# EasyEDA Pro project 2.4G8通道接收板2代.epro

# Schematic 2.4G8通道接收板3代
Create Date: 2024-01-06; Page Name: P1; Project Name: 遥控小车驱动小板; Schematic Name: 2.4G8通道接收板3代; Update Date: 2024-01-06; Company: 嘉立创EDA; Page Size: A4; Version: V1.0
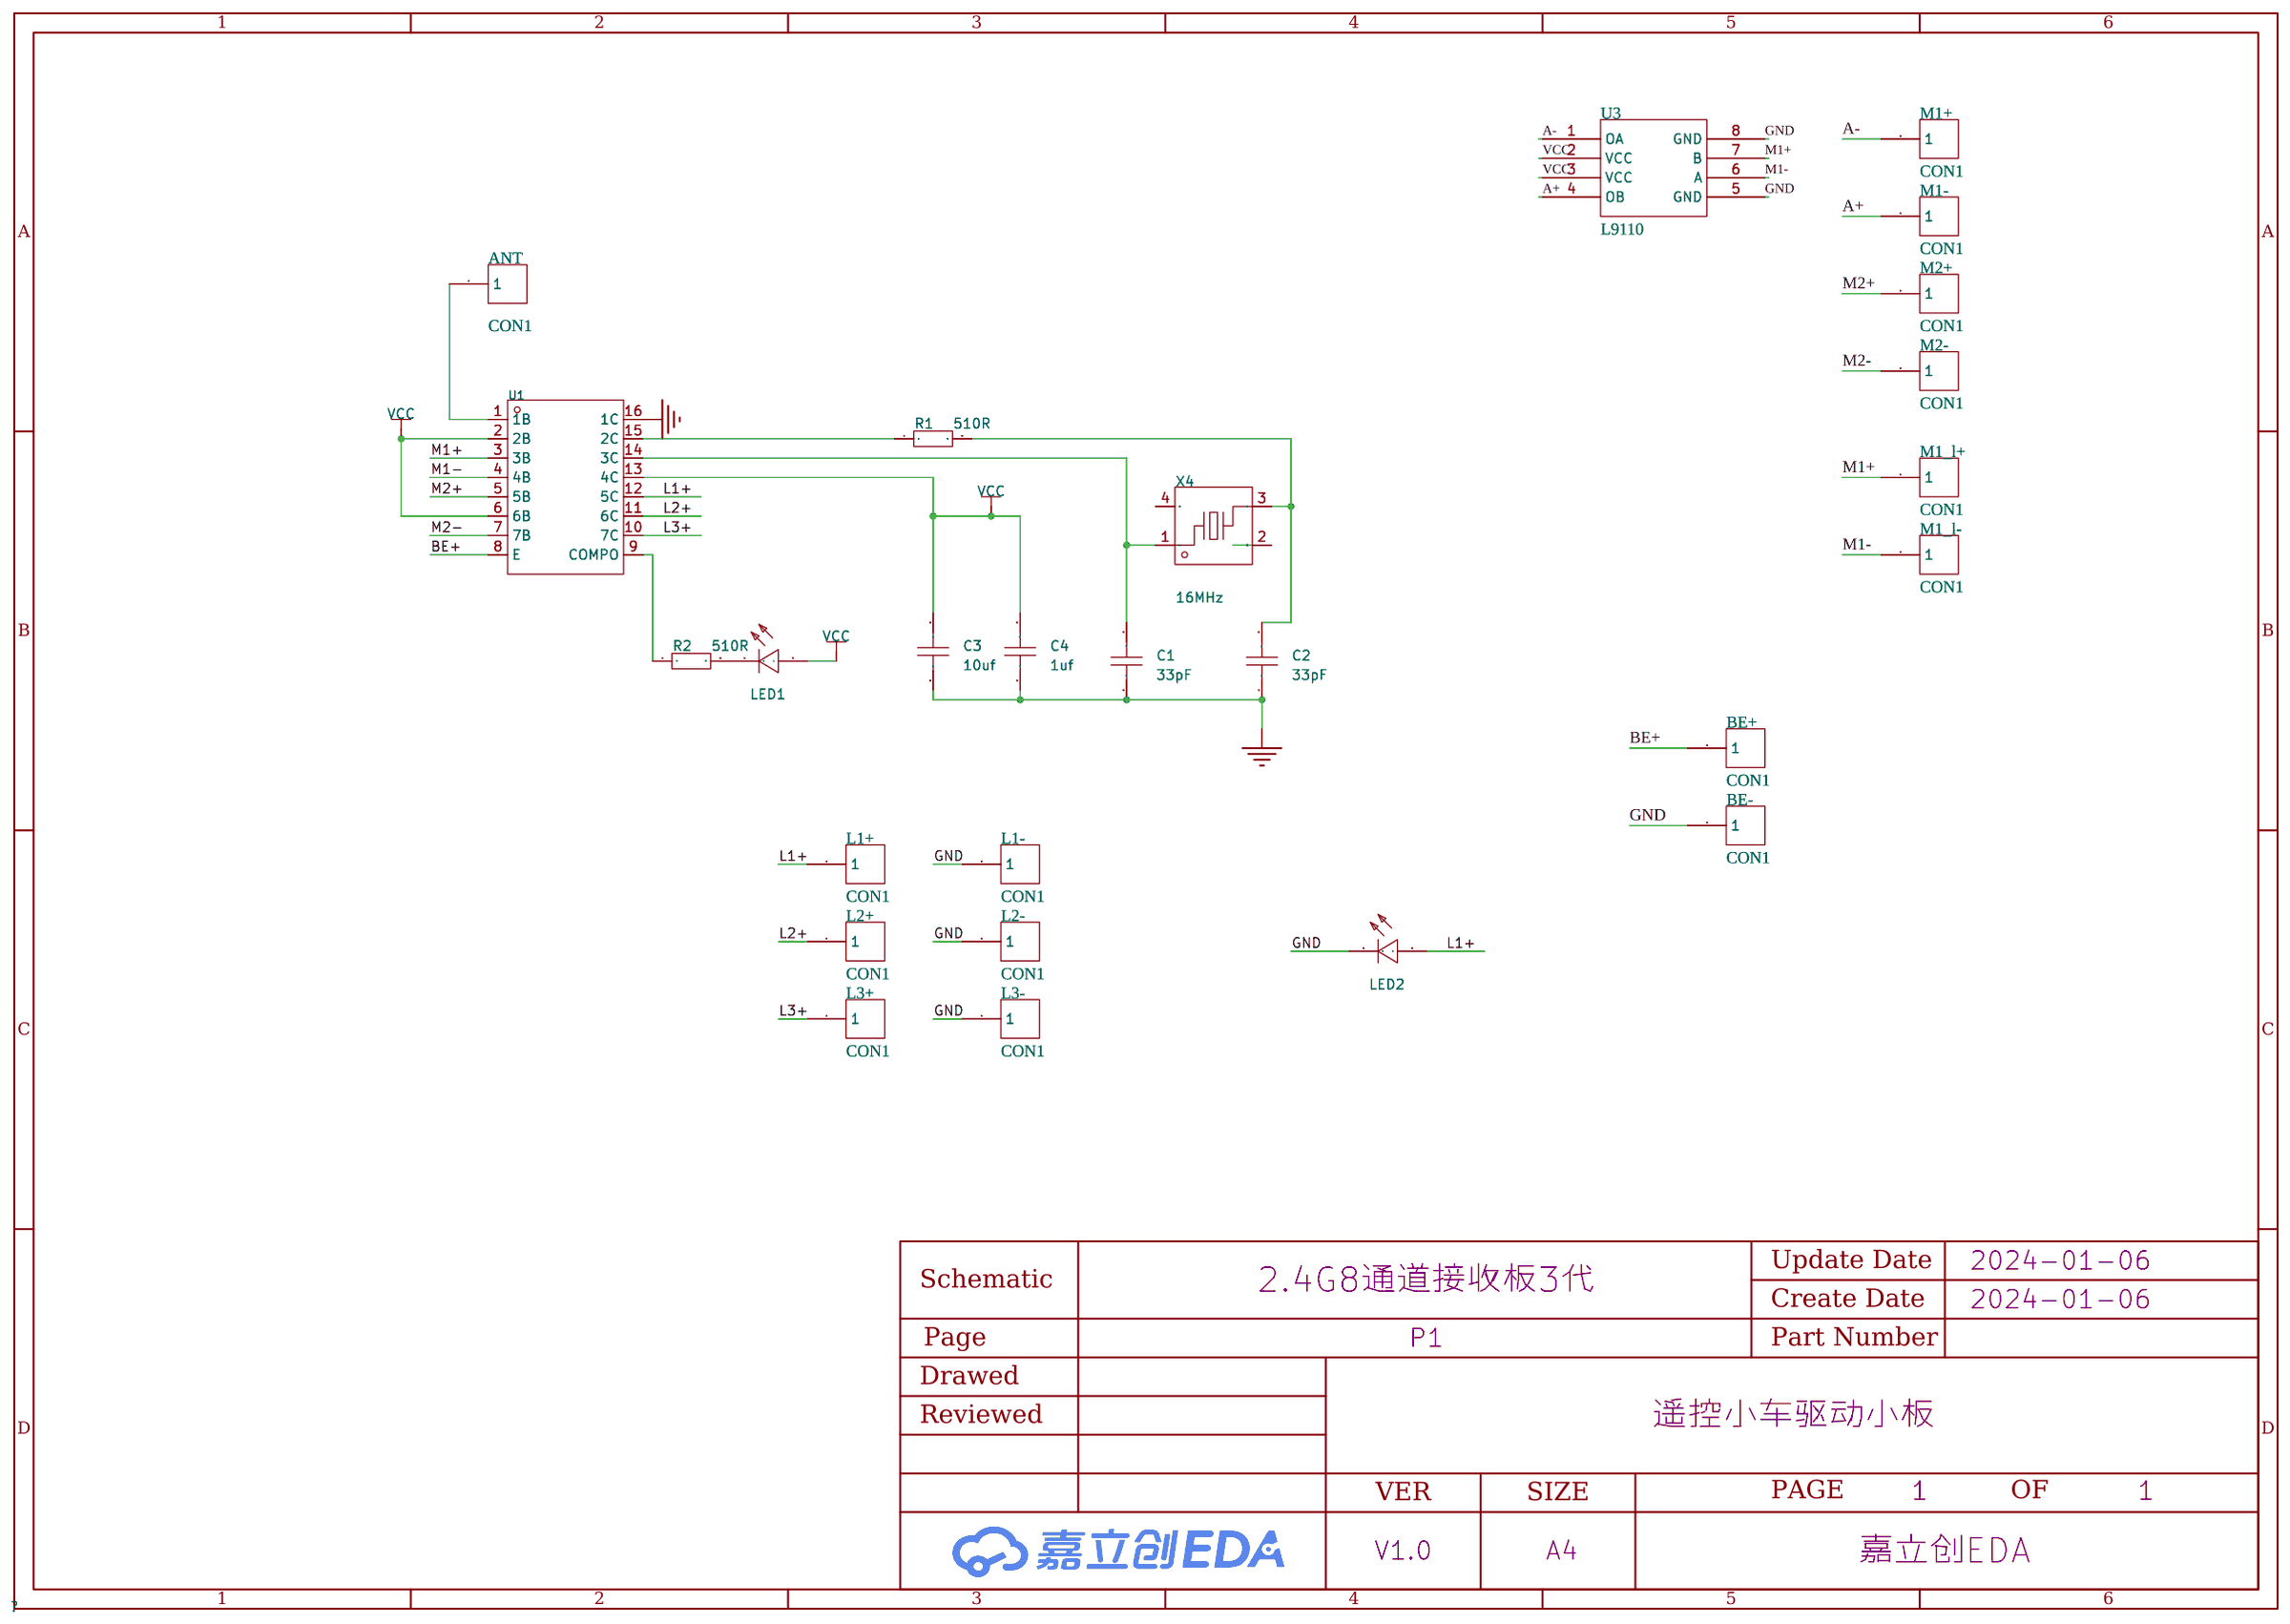
[diagram p0: schematic sheet]

## Parts
ANT  CON1  [CON1_2]
BE+  CON1  [CON1_2]
BE-  CON1  [CON1_2]
C1  33pF  [C0603]
C2  33pF  [C0603]
C3  10uf  [C0603]
C4  1uf  [C0603]
L1+  CON1  [CON1_2]
L1-  CON1  [CON1_2]
L2+  CON1  [CON1_2]
L2-  CON1  [CON1_2]
L3+  CON1  [CON1_2]
L3-  CON1  [CON1_2]
LED1  NCD0603R1  [LED0603-RD_RED]
LED2  NCD0603R1  [LED0603-RD_RED]
M1+  CON1  [CON1_2]
M1-  CON1  [CON1_2]
M1_l+  CON1  [CON1_2]
M1_l-  CON1  [CON1_2]
M2+  CON1  [CON1_2]
M2-  CON1  [CON1_2]
R1  510R  [R0603]
R2  510R  [R0603]
U1  ULN2003A  [SOP-16_L10.0-W3.9-P1.27-LS6.0-BL]
U3  L9110  [SOP8]
X4  16MHz  [CRYSTAL-SMD_4P-L2.0-W1.6-BL]

## Library data of the parts
ANT BE+ BE- L1+ L1- L2+ L2- L3+ L3- M1+ M1- M1_l+ M1_l- M2+ M2- = CON1: Library Name: 杰梗原理图库
C1-C4 = CAP_0603: Supplier Footprint: 0603
LED1 LED2 = NCD0603R1_C84263: 发光颜色:红色;功率:65mW;透镜颜色:无色透明;主波长:615nm~630nm;发光强度:80mcd~220mcd;发光角度:130°;工作温度:-30℃~+85℃;; LCSC Part Name: 红灯 0603红灯   正贴; Supplier Part: C84263; Manufacturer: 国星光电; Supplier Footprint: 0603; JLCPCB Part Class: 扩展库; Datasheet: https://atta.szlcsc.com/upload/public/pdf/source/20200820/C84263_DABC6A75E58F576973B407FDBA283D60.pdf; Supplier: LCSC; Emitted Color: 红色; Forward Voltage (VF): 1.6V~2.6V; Forward Current: 20mA; Power Dissipation: 65mW; Lens Color: 无色透明; Dominant Wavelength: 615nm~630nm; Luminous Intensity: 80mcd~220mcd; Viewing Angle: 130°; Operating Temperature: -30℃~+85℃
R1 R2 = Res_0603: Supplier Footprint: 0603
U1 = ULN2003A_C482013: 开态输入电压(VI(on)@Vce,Ic):3V@2V,300mA;集射极饱和压降(VCE(sat)@Ii,Ic):900mV;开态输入电流(Ii@Vi):930uA@3.85V;; Supplier Part: C482013; Manufacturer: UMW(友台半导体); Supplier Footprint: SOP-16; JLCPCB Part Class: 扩展库; Datasheet: https://atta.szlcsc.com/upload/public/pdf/source/20210729/C482013_EA98BD063A0F1E79EB7301A16A5D0011.pdf; Supplier: LCSC; ON-state input   voltage(VI(on)@Vce,Ic): 3V@2V,300mA; Collector-emitter   saturation voltage (VCE(sat)@Ii,Ic): 900mV; Output leakage current (Icex@Vce): 20uA@50V; Input current (Ii@Vi): 930uA@3.85V; Off-state input current (Ii(off)@Vce,Ic): 100uA@500uA; Clamp Diode Leakage Current (IR@VR): 5uA@50V; Clamp Diode Forward Voltage (VF@IF): 1.7V@350mA; Input Capacitance (Ci): 15pF; Operating Temperature: -40℃~+85℃
U3 = L9110: Library Name: 杰梗原理图库
X4 = XL7EL89COI-111YLC-16M: 晶振类型:贴片无源晶振;频率:16MHz;常温频差:±10ppm;负载电容:12pF;频率稳定度(全温):±20ppm;; LCSC Part Name: 16MHz ±10ppm 12pF; Supplier Part: C2965579; Manufacturer: YXC(扬兴晶振); Supplier Footprint: SMD2016-4P; JLCPCB Part Class: 扩展库; Datasheet: https://atta.szlcsc.com/upload/public/pdf/source/20220121/6B4B3E7EF7974858943D806BF8CACEA3.pdf; Supplier: LCSC; Crystal Type: 贴片无源晶振; Normal temperature Frequency Tolerance: ±10ppm; Load Capacitance: 12pF; Frequency Stability(Full temperature range): ±20ppm; Operating Temperature: -40℃~+85℃

## Nets
GND: BE-.1 C1.1 C2.1 C3.1 C4.1 L1-.1 L2-.1 L3-.1 LED2.1(K) U1.16(1C) U3.5(GND) U3.8(GND)
VCC: C3.2 C4.2 LED1.2(A) U1.2(2B) U1.6(6B) U1.13(4C) U3.2(VCC) U3.3(VCC)
A+: M1-.1 U3.4(OB)
A-: M1+.1 U3.1(OA)
BE+: BE+.1 U1.8(E)
L1+: L1+.1 LED2.2(A) U1.12(5C)
L2+: L2+.1 U1.11(6C)
L3+: L3+.1 U1.10(7C)
M1+: M1_l+.1 U1.3(3B) U3.7(B)
M1-: M1_l-.1 U1.4(4B) U3.6(A)
M2+: M2+.1 U1.5(5B)
M2-: M2-.1 U1.7(7B)
$1N1074: LED1.1(K) R2.2
Net-(ANT-1): ANT.1 U1.1(1B)
Net-(C1-2): C1.2 U1.14(3C) X4.1
Net-(C2-2): C2.2 R1.2 X4.3
Net-(R1-1): R1.1 U1.15(2C)
Net-(R2-1): R2.1 U1.9(COMPO)

Not connected (* = marked no-connect by the designer): X4 2(GND) 4(GND)

# Board 2.4G8通道接收板3代
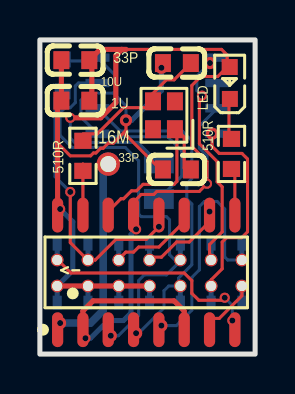
[diagram p1: board, top side]
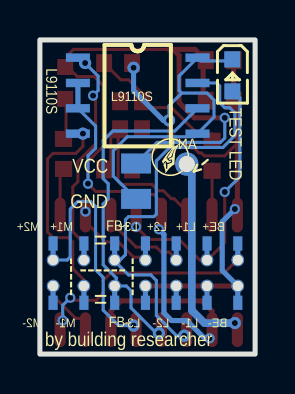
[diagram p2: board, bottom side, seen from below]

Outline 10.79 x 15.75 mm; copper layers: Top Layer, Bottom Layer. Coordinates in mm from the lower left corner of the outline.
Outline path: rectangle 0,15.75 10.79,0
Stack: Top Layer 0.035mm / Dielectric1 1.51mm FR4 er 4.5 / Bottom Layer 0.035mm

## Design rules (mm)
template: JLCPCB Capability(Two Layers Board)
spacing copperThickness1oz (default): track to track 0.102, other pairs 0.152 to 0.3
spacing copperThickness2oz: track to track 0.203, other pairs 0.152 to 0.3
track width copperThickness1oz (default): min 0.127, default 0.254, max 2.54
track width copperThickness2oz: min 0.203, default 0.254, max 2.54
differential pair differentialPair (default): width min 0.127, default 0.254, max 2.54; gap min 0.152, default 0.152
via viaSize (default): diameter min 0.5, default 0.61, max 10; hole min 0.3, default 0.305, max 6.3

## Placement (name value [footprint] x y rotation side)
1U  1uf  [C0603]  1.78 12.7 0 top
10U  10uf  [C0603]  1.78 14.73 0 top
33P  -  [C0603]  6.87 9.25 0 top
33P#2  -  [C0603]  6.87 14.59 0 top
510R  510R  [R0603]  2.16 9.94 90 top
ANT  CON1  [con1_2]  3.43 9.52 0 top
BE+  CON1  [CON1_2]  0.87 4.72 0 top
BE-  CON1  [CON1_2]  0.87 3.41 0 top
L1+  CON1  [CON1_2]  2.41 4.72 90 top
L1-  CON1  [CON1_2]  2.41 3.41 0 top
L2+  CON1  [CON1_2]  3.96 4.72 90 top
L2-  CON1  [CON1_2]  3.96 3.41 0 top
L3+  CON1  [CON1_2]  5.5 4.72 90 top
L3-  CON1  [CON1_2]  5.5 3.41 0 top
L9110S  L9110  [SOP8]  8.89 14.86 180 bottom
LED1  NCD0603R1  [LED0603-RD_RED]  9.53 13.59 90 top
LED2  NCD0603R1  [LED0603-RD_RED]  1.14 13.97 270 bottom
M1+  CON1  [CON1_2]  8.59 4.72 0 top
M1-  CON1  [CON1_2]  8.59 3.41 0 top
M2+  CON1  [CON1_2]  10.13 4.72 0 top
M2-  CON1  [CON1_2]  10.13 3.41 0 top
M2_l+  CON1  [CON1_2]  7.04 4.72 0 top
M2_l-  CON1  [CON1_2]  7.04 3.41 90 top
NOREF  -  [Pad_e1017]  10.13 5.54 0 top
NOREF#2  -  [Pad_e938]  7.04 2.57 0 top
NOREF#3  -  [Pad_e945]  3.96 2.57 0 top
NOREF#4  -  [Pad_e935]  10.13 2.57 0 top
NOREF#5  -  [Pad_e1019]  7.04 5.54 0 top
NOREF#6  -  [Pad_e1018]  8.59 5.54 0 top
NOREF#7  -  [Pad_e17]  5.97 9.56 0 top
NOREF#8  -  [Pad_e1020]  5.5 5.54 0 top
NOREF#9  -  [Pad_e937]  8.59 2.57 0 top
NOREF#10  -  [Pad_e1022]  2.41 5.54 0 top
NOREF#11  -  [Pad_e956]  2.41 2.57 0 top
NOREF#12  -  [Pad_e1021]  3.96 5.54 0 top
NOREF#13  -  [SOP-16_L10.0-W3.9-P1.27-LS6.0-BL]  5.33 4.1 0 top
NOREF#14  -  [Pad_e957]  0.87 2.57 0 top
NOREF#15  -  [Pad_e19]  5.97 7.78 0 top
NOREF#16  -  [Pad_e942]  5.5 2.57 0 top
NOREF#17  -  [Pad_e1023]  0.87 5.54 0 top
R2  510R  [R0603]  9.61 10.03 90 top
X4  16MHz  [CRYSTAL-SMD_4P-L2.0-W1.6-BL]  6.22 11.97 90 top

## Footprints (pads in the part's own frame, mm; a bottom-side part is the same pattern mirrored in y, then rotated)
C0603
  rect 0.8x0.9 smd: 1(-0.7,0) 2(0.7,0)
CON1_2
  round 0.635 hole 0.508: 1(0,0)
con1_2
  round 1.169 hole 0.8: 1(0,0)
CRYSTAL-SMD_4P-L2.0-W1.6-BL
  rect 0.9x0.8 smd: 1(-0.7,-0.55) 2(0.7,-0.55) 3(0.7,0.55) 4(-0.7,0.55)
LED0603-RD_RED
  rect 0.8x0.8 smd: 1(-0.799,-0.004) 2(0.799,0.004)
Pad_e17
  rect 1.5x1 smd far side: 2(0,0)
Pad_e19
  rect 1.5x1 smd far side: 2(0,0)
Pad_e935
  rect 0.457x0.711 smd far side: 1(0,0)
Pad_e937
  rect 0.457x0.711 smd far side: 1(0,0)
Pad_e938
  rect 0.457x0.711 smd far side: 1(0,0)
Pad_e942
  rect 0.457x0.711 smd far side: 1(0,0)
Pad_e945
  rect 0.457x0.711 smd far side: 1(0,0)
Pad_e956
  rect 0.457x0.711 smd far side: 1(0,0)
Pad_e957
  rect 0.457x0.711 smd far side: 1(0,0)
Pad_e1017
  rect 0.457x0.711 smd far side: 1(0,0)
Pad_e1018
  rect 0.457x0.711 smd far side: 1(0,0)
Pad_e1019
  rect 0.457x0.711 smd far side: 1(0,0)
Pad_e1020
  rect 0.457x0.711 smd far side: 1(0,0)
Pad_e1021
  rect 0.457x0.711 smd far side: 1(0,0)
Pad_e1022
  rect 0.457x0.711 smd far side: 1(0,0)
Pad_e1023
  rect 0.457x0.711 smd far side: 1(0,0)
R0603
  rect 0.806x0.864 smd: 1(-0.753,0) 2(0.753,0)
SOP8
  rect 1.2x0.42 smd: 1(0,0) 2(0,-1.27) 3(0,-2.54) 4(0,-3.81) 5(6,-3.81) 6(6,-2.54) 7(6,-1.27) 8(6,0)
SOP-16_L10.0-W3.9-P1.27-LS6.0-BL
  oval 0.56x1.745 smd: 1(-4.445,-2.873) 2(-3.175,-2.873) 3(-1.905,-2.873) 4(-0.635,-2.873) 5(0.635,-2.873) 6(1.905,-2.873) 7(3.175,-2.873) 8(4.445,-2.873) 9(4.445,2.873) 10(3.175,2.873) 11(1.905,2.873) 12(0.635,2.873) 13(-0.635,2.873) 14(-1.905,2.873) 15(-3.175,2.873) 16(-4.445,2.873)

## Nets
GND: 1U.1 10U.1 33P.1 33P#2.1 BE-.1 L1-.1 L2-.1 L3-.1 L9110S.5 L9110S.8 LED2.1 NOREF#3.1 NOREF#11.1 NOREF#13.16 NOREF#14.1 NOREF#15.2 NOREF#16.1
VCC: 1U.2 10U.2 L9110S.2 L9110S.3 LED1.2 NOREF#7.2 NOREF#13.2 NOREF#13.6 NOREF#13.13
A+: L9110S.4 M1-.1 NOREF#9.1
A-: L9110S.1 M1+.1 NOREF#6.1
BE+: BE+.1 NOREF#13.8 NOREF#17.1
L1+: L1+.1 LED2.2 NOREF#10.1 NOREF#13.12
L2+: L2+.1 NOREF#12.1 NOREF#13.11
L3+: L3+.1 NOREF#8.1 NOREF#13.10
M1+: L9110S.7 M2_l+.1 NOREF#5.1 NOREF#13.3
M1-: L9110S.6 M2_l-.1 NOREF#2.1 NOREF#13.4
M2+: M2+.1 NOREF.1 NOREF#13.5
M2-: M2-.1 NOREF#4.1 NOREF#13.7
$1N667: 510R.1 NOREF#13.15
$1N672: 33P.2 NOREF#13.14 X4.1
$1N923: ANT.1 NOREF#13.1
$1N1074: LED1.1 R2.2
$1N1154: NOREF#13.9 R2.1
$1N4258: 33P#2.2 510R.2 X4.3
$1N4264: X4.2

Pads without a net: X4 4

## Via types
v1: diameter 0.61, hole 0.305, Top Layer to Bottom Layer, 8 vias
v2: diameter 0.508, hole 0.305, Top Layer to Bottom Layer, 11 vias

## Routing (per net, layer and track width the routed paths; a pad name or vN(x,y) marks a point on that pad's centre or on a via; arc(x,y) is an arc through that point)
GND: length 48.7
  Top Layer w0.152: 4.32,11.21 4.32,10.98 6.17,9.13 6.17,9.35 ; 4.32,11.21 3.68,10.57 3.43,10.57 3.18,10.32 3.05,10.32 2.81,10.08 2.69,10.08 2.54,9.94 1.52,9.94 0.89,10.57 ; 4.32,11.21 v1(4.32,11.72)
  Top Layer w0.254: 3.86,3.41 BE-.1 ; 1.21,14.73 1.08,14.6 1U.1 0.89,12.51 0.89,6.94 ; 3.91,3.41 5.44,3.41
  Bottom Layer w0.152: 5.97,7.91 6.1,7.91 7.11,8.92 7.11,10.19 6.41,10.9 3.04,10.9 L9110S.5 2.06,11.88 2.06,12.73 2.41,13.08 3.68,13.08 ; 1.01,14.69 2.73,14.69 L9110S.8 3.81,13.94 3.81,13.21 3.68,13.08 ; 3.68,13.08 4.32,12.45 4.32,11.73 4.49,11.72 v1(4.32,11.72)
  Bottom Layer w0.254: v2(1.02,7.27) 1.65,6.64 1.65,4.19 BE-.1 NOREF#14.1 ; L3-.1 NOREF#16.1 ; L1-.1 NOREF#11.1 ; L2-.1 NOREF#3.1 ; 4.49,11.72 4.6,11.72 6.1,13.21 v1(6.1,14.35)
VCC: length 53.7
  Top Layer w0.152: 4.32,15.27 9.11,15.27 9.39,14.99 9.39,14.39 ; 9.39,14.39 LED1.2 ; 9.39,14.39 8.92,13.91 8.07,13.91 7.62,13.46 7.62,10.41 8.38,9.65 v2(8.38,8.54) 7.99,8.15 5.87,8.15 5.72,8 5.08,8 4.7,7.62 4.7,6.94
  Top Layer w0.254: 7.24,1.19 7.24,2.16 6.73,2.67 2.67,2.67 2.16,2.16 2.16,1.19 ; 1U.2 2.6,12.83 2.6,14.86 3.02,15.27 4.11,15.27 ; 1.52,11.97 1.65,11.84 3.05,11.84 3.81,12.6 3.81,14.97 4.11,15.27 ; 4.11,15.27 4.32,15.27
  Bottom Layer w0.152: v2(1.52,11.84) 1.52,10.83 1.74,10.61 4.92,10.61 NOREF#7.2 ; L9110S.3 8,11.43 8,10.32 8.38,9.94 v2(8.38,8.54)
  Bottom Layer w0.254: v2(2.29,0.79) 2.54,0.79 3.43,1.68 4.19,1.68 4.57,2.06 4.57,6 v2(4.83,6.25) ; L9110S.2 L9110S.3
A+: length 11.1
  Top Layer w0.152: v1(8.64,11.05) 8.64,10.41 8.99,10.06 10.13,10.06 10.41,9.78 10.41,6.13 10.12,5.84 9.36,5.84 9.14,5.62 9.14,4.28 8.59,3.72 M1-.1
  Bottom Layer w0.254: M1-.1 NOREF#9.1
A-: length 12
  Top Layer w0.152: M1+.1 8.51,4.79 8.51,5.49 9.14,6.13 9.14,8.38 8.89,8.64 8.89,9.65 8,10.54 8,12.83 v2(8.13,12.95)
  Bottom Layer w0.152: v2(8.13,12.95) 7.87,13.21 7.87,13.94 v1(8.53,14.59)
  Bottom Layer w0.254: M1+.1 8.59,5.62
BE+: length 11.8
  Top Layer w0.152: 0.9,4.72 1.56,4.06 7.24,4.06 7.62,3.68 7.62,3.05 7.97,2.7 9.14,2.7 v2(9.27,2.83)
  Bottom Layer w0.152: v2(9.65,1.68) 9.65,2.44 v2(9.27,2.83)
  Bottom Layer w0.254: BE+.1 0.87,5.62
L1+: length 14.3
  Top Layer w0.152: v2(5.97,6.38) 5.33,5.75 3.81,5.75 2.78,4.72 2.39,4.72 1.52,5.59 v2(1.52,8.13)
  Bottom Layer w0.152: 1.01,13.1 0.76,12.85 0.76,8.89 v2(1.52,8.13)
  Bottom Layer w0.254: L1+.1 2.41,5.62
L2+: length 5.3
  Top Layer w0.152: 3.91,4.72 4.31,5.11 4.7,5.11 4.95,5.37 5.97,5.37 7.24,6.64 7.24,6.94
  Bottom Layer w0.254: L2+.1 3.96,5.62
L3+: length 5.3
  Top Layer w0.152: 5.44,4.72 5.58,4.86 6.1,4.86 6.86,5.62 7.49,5.62 8.51,6.64 v2(8.51,7.14)
  Bottom Layer w0.254: L3+.1 5.5,5.53 5.46,5.58
M1+: length 22.3
  Bottom Layer w0.152: 6.96,4.72 6.77,4.72 6.5,4.98 6.5,6.74 6.35,6.89 5.08,6.89 4.95,7.02 4.95,9.68 4.28,10.36 1.61,10.36 1.02,10.95 1.02,12.1 1.27,12.35 1.52,12.35 1.78,12.6 1.78,13.44 1.93,13.59 L9110S.7 ; 6.96,4.72 6.96,4.58 6.35,3.97 5.23,3.97 4.95,3.69 4.95,1.94 3.94,0.92 v1(3.56,0.92) ; 6.96,4.72 M2_l+.1
  Bottom Layer w0.254: M2_l+.1 7.04,5.62
M1-: length 17.7
  Bottom Layer w0.152: v1(4.83,1.05) 4.95,1.05 6.22,2.32 6.22,3.17 6.46,3.41 6.96,3.41 6.96,3.82 7.62,4.48 7.62,7.52 7.37,7.78 7.37,8.54 7.62,8.8 7.62,10.7 7.14,11.18 4.03,11.18 L9110S.6 2.96,12.32
  Bottom Layer w0.254: M2_l-.1 NOREF#2.1
M2+: length 13
  Bottom Layer w0.152: v1(6.1,1.43) 6.84,1.43 7.62,2.2 7.62,3.84 8,4.22 8,7.4 8.25,7.65 8.89,7.65 9.27,7.27 9.27,4.87 9.42,4.72 M2+.1
  Bottom Layer w0.254: M2+.1 10.13,5.62
M2-: length 4
  Top Layer w0.152: M2-.1 10.13,2.92 9,1.79 8.51,1.79 8.51,1.19
  Bottom Layer w0.254: M2-.1 NOREF#4.1
$1N667: length 2.6
  Top Layer w0.152: 2.16,9.53 2.16,6.94
$1N672: length 9.2
  Top Layer w0.152: 7.44,9.13 7.24,9.33 7.24,10.88 6.87,11.24 6.87,8.65 6.73,8.51 5.18,8.51 4.85,8.19 4.6,8.19 4.2,7.79 4.06,7.79 3.43,7.15 3.43,6.94
$1N923: length 9.9
  Bottom Layer w0.381: 3.56,9.52 3.18,9.14 3.18,2.19 2.54,1.56 v1(1.02,1.56)
$1N1074: length 2
  Top Layer w0.152: 9.48,10.79 9.48,12.71 9.4,12.79
$1N1154: length 2.5
  Top Layer w0.152: 9.48,9.28 9.78,8.98 9.78,6.94
$1N4258: length 7.1
  Top Layer w0.152: 33P#2.2 6.73,13.75 6.35,13.75 5.67,13.07 X4.3 5.35,12.35 4.19,12.35 2.88,11.04 2.16,11.04

## Text on the board
Bottom Silkscreen Layer: -> | FB- | FB+ | L9110S | TEST LED | VCC | GND | by building researcher | ------ | = | -----
Top Silkscreen Layer: -> | LED | 510R | 16M
